# Altium schematic sheet UBX_NORA_B1_SCHEM_0001_NORA_B1_Module.SchDoc: UBX_NORA_B1_SCHEM_0001_NORA_B1_Module
size A3; Date: 7/24/2020; CompanyName: U-blox; DrawnBy: EMOO; Engineer: EMOO; Organization: U-blox; Address1: 3950 Fairview Industrial Dr SE #100; Address2: Salem, OR 97302; SheetNumber: 1; SheetTotal: 6; Website: www.u-blox.com; SheetSize: B; SheetTitle: NORA_B1
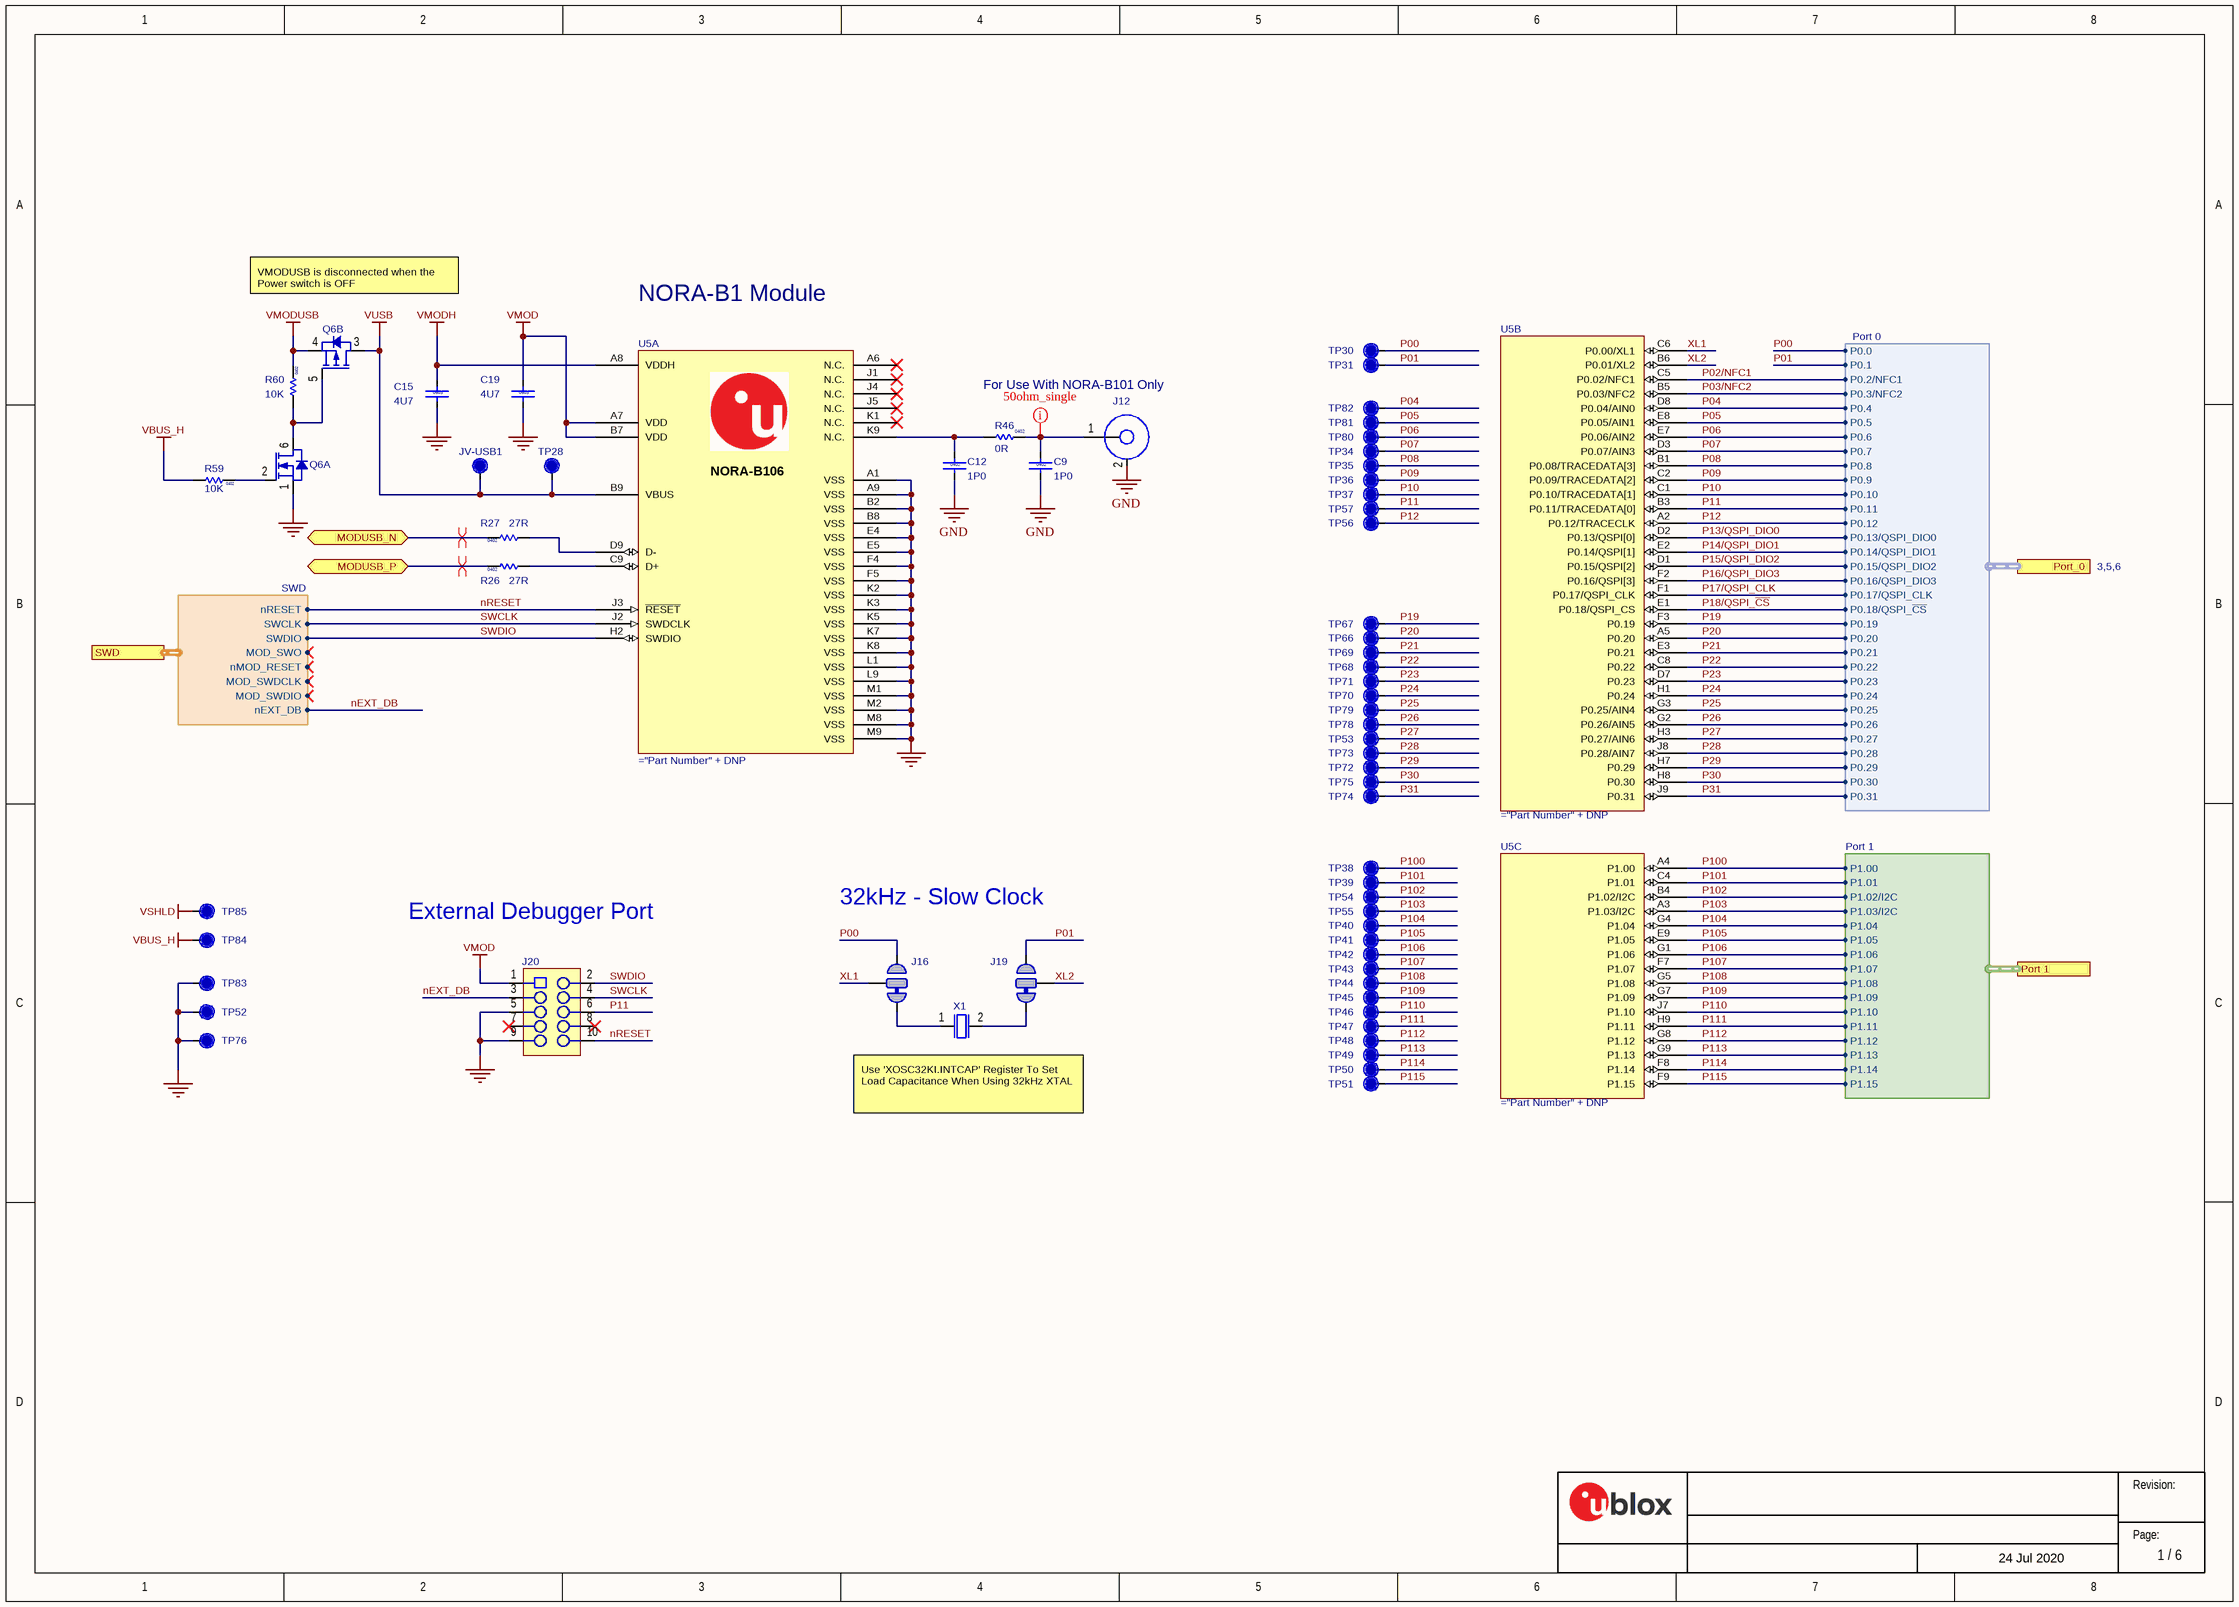
[diagram p0: UBX_NORA_B1_SCHEM_0001_NORA_B1_Module.SchDoc]

## Parts
C9  value 1P0  Size: 0402  [Cap 0402 HD]
C12  value 1P0  Size: 0402  [Cap 0402 HD]
C15  value 4U7  Size: 0603  [CAP 0603 HD]
C19  value 4U7  Size: 0603  [CAP 0603 HD]
J12  (no value)  [U.FL_3Pin]
J16  (no value)  [Solderbridge-Option]  (net tie, no BOM)
J19  (no value)  [Solderbridge-Option]  (net tie, no BOM)
J20  (no value)  [FTSH-105-01-F-DV-K]
JV-USB1  TP  [TP10R_NO_SILK]  (value not drawn)  (no BOM)
Q6  (no value)  [SOT-563]  (parts A,B of 2)
R26  value 27R  Size: 0402  [RES 0402 HD]
R27  value 27R  Size: 0402  [RES 0402 HD]
R46  value 0R  Size: 0402  [RES 0402 HD]
R59  value 10K  Size: 0402  [RES 0402 HD]
R60  value 10K  Size: 0402  [RES 0402 HD]
TP28  TP  [TP10R_NO_SILK]  (value not drawn)  (no BOM)
TP30  TP  [TP10R_NO_SILK]  (value not drawn)  (no BOM)
TP31  TP  [TP10R_NO_SILK]  (value not drawn)  (no BOM)
TP34  TP  [TP10R_NO_SILK]  (value not drawn)  (no BOM)
TP35  TP  [TP10R_NO_SILK]  (value not drawn)  (no BOM)
TP36  TP  [TP10R_NO_SILK]  (value not drawn)  (no BOM)
TP37  TP  [TP10R_NO_SILK]  (value not drawn)  (no BOM)
TP38  TP  [TP10R_NO_SILK]  (value not drawn)
TP39  TP  [TP10R_NO_SILK]  (value not drawn)
TP40  TP  [TP10R_NO_SILK]  (value not drawn)
TP41  TP  [TP10R_NO_SILK]  (value not drawn)
TP42  TP  [TP10R_NO_SILK]  (value not drawn)
TP43  TP  [TP10R_NO_SILK]  (value not drawn)
TP44  TP  [TP10R_NO_SILK]  (value not drawn)
TP45  TP  [TP10R_NO_SILK]  (value not drawn)
TP46  TP  [TP10R_NO_SILK]  (value not drawn)
TP47  TP  [TP10R_NO_SILK]  (value not drawn)
TP48  TP  [TP10R_NO_SILK]  (value not drawn)
TP49  TP  [TP10R_NO_SILK]  (value not drawn)
TP50  TP  [TP10R_NO_SILK]  (value not drawn)
TP51  TP  [TP10R_NO_SILK]  (value not drawn)
TP52  TP  [TP10R_NO_SILK]  (value not drawn)  (no BOM)
TP53  TP  [TP10R_NO_SILK]  (value not drawn)
TP54  TP  [TP10R_NO_SILK]  (value not drawn)
TP55  TP  [TP10R_NO_SILK]  (value not drawn)
TP56  TP  [TP10R_NO_SILK]  (value not drawn)  (no BOM)
TP57  TP  [TP10R_NO_SILK]  (value not drawn)  (no BOM)
TP66  TP  [TP10R_NO_SILK]  (value not drawn)
TP67  TP  [TP10R_NO_SILK]  (value not drawn)
TP68  TP  [TP10R_NO_SILK]  (value not drawn)
TP69  TP  [TP10R_NO_SILK]  (value not drawn)
TP70  TP  [TP10R_NO_SILK]  (value not drawn)
TP71  TP  [TP10R_NO_SILK]  (value not drawn)
TP72  TP  [TP10R_NO_SILK]  (value not drawn)
TP73  TP  [TP10R_NO_SILK]  (value not drawn)
TP74  TP  [TP10R_NO_SILK]  (value not drawn)
TP75  TP  [TP10R_NO_SILK]  (value not drawn)
TP76  TP  [TP10R_NO_SILK]  (value not drawn)  (no BOM)
TP78  TP  [TP10R_NO_SILK]  (value not drawn)
TP79  TP  [TP10R_NO_SILK]  (value not drawn)
TP80  TP  [TP10R_NO_SILK]  (value not drawn)  (no BOM)
TP81  TP  [TP10R_NO_SILK]  (value not drawn)  (no BOM)
TP82  TP  [TP10R_NO_SILK]  (value not drawn)  (no BOM)
TP83  TP  [TP10R_NO_SILK]  (value not drawn)  (no BOM)
TP84  TP  [TP10R_NO_SILK]  (value not drawn)  (no BOM)
TP85  TP  [TP10R_NO_SILK]  (value not drawn)  (no BOM)
U5  (no value)  [NORA-B106]  (parts A,B,C of 3)
X1  (no value)  [XTAL_3215]

## Ports
MODUSB_N (bidir), MODUSB_P (bidir), Port 1 (harness Port 1), Port_0 (harness Port 0), SWD (harness SWD)

## Harnesses
Port 0: P0.4, P0.5, P0.6, P0.7, P0.8, P0.9, P0.10, P0.11, P0.12, P0.19, P0.20, P0.21, P0.22, P0.23, P0.24, P0.25, P0.26, P0.27, P0.28, P0.29, P0.30, P0.31, P0.3/NFC2, P0.2/NFC1, P0.13/QSPI_DIO0, P0.14/QSPI_DIO1, P0.15/QSPI_DIO2, P0.16/QSPI_DIO3, P0.18/QSPI_~{CS}, P0.17/QSPI_CLK, P0.0, P0.1
Port 1: P1.00, P1.01, P1.02/I2C, P1.03/I2C, P1.04, P1.05, P1.06, P1.07, P1.08, P1.09, P1.10, P1.11, P1.12, P1.13, P1.14, P1.15
SWD: MOD_SWDIO, MOD_SWDCLK, SWCLK, SWDIO, nMOD_RESET, MOD_SWO, nRESET, nEXT_DB

## Nets
GND: C9.2 C12.2 C15.2 C19.2 J12.2 J20.5 J20.9 Q6.1(S1) TP52.1 TP76.1 TP83.1 U5.A1(VSS) U5.A9(VSS) U5.B2(VSS) U5.B8(VSS) U5.E4(VSS) U5.E5(VSS) U5.F4(VSS) U5.F5(VSS) U5.K2(VSS) U5.K3(VSS) U5.K5(VSS) U5.K7(VSS) U5.K8(VSS) U5.L1(VSS) U5.L9(VSS) U5.M1(VSS) U5.M2(VSS) U5.M8(VSS) U5.M9(VSS)
VBUS_H: R59.1 TP84.1
VMOD: C19.1 J20.1 U5.A7(VDD) U5.B7(VDD)
VMODH: C15.1 U5.A8(VDDH)
VMODUSB: Q6.4(S2) R60.2
VSHLD: TP85.1
VUSB: JV-USB1.1 Q6.3(D2) TP28.1 U5.B9(VBUS)
MODUSB_N: R27.2 ; port MODUSB_N
MODUSB_P: R26.2 ; port MODUSB_P
nEXT_DB: J20.3 ; port SWD.nEXT_DB
nRESET: J20.10 U5.J3(~{RESET}) ; port SWD.nRESET
P00: J16.3 TP30.1 ; port Port_0.P0.0
P01: J19.3 TP31.1 ; port Port_0.P0.1
P02/NFC1: U5.C5(P0.02/NFC1) ; port Port_0.P0.2/NFC1
P03/NFC2: U5.B5(P0.03/NFC2) ; port Port_0.P0.3/NFC2
P04: TP82.1 U5.D8(P0.04/AIN0) ; port Port_0.P0.4
P05: TP81.1 U5.E8(P0.05/AIN1) ; port Port_0.P0.5
P06: TP80.1 U5.E7(P0.06/AIN2) ; port Port_0.P0.6
P07: TP34.1 U5.D3(P0.07/AIN3) ; port Port_0.P0.7
P08: TP35.1 U5.B1(P0.08/TRACEDATA[3]) ; port Port_0.P0.8
P09: TP36.1 U5.C2(P0.09/TRACEDATA[2]) ; port Port_0.P0.9
P10: TP37.1 U5.C1(P0.10/TRACEDATA[1]) ; port Port_0.P0.10
P11: J20.6 TP57.1 U5.B3(P0.11/TRACEDATA[0]) ; port Port_0.P0.11
P12: TP56.1 U5.A2(P0.12/TRACECLK) ; port Port_0.P0.12
P13/QSPI_DIO0: U5.D2(P0.13/QSPI[0]) ; port Port_0.P0.13/QSPI_DIO0
P14/QSPI_DIO1: U5.E2(P0.14/QSPI[1]) ; port Port_0.P0.14/QSPI_DIO1
P15/QSPI_DIO2: U5.D1(P0.15/QSPI[2]) ; port Port_0.P0.15/QSPI_DIO2
P16/QSPI_DIO3: U5.F2(P0.16/QSPI[3]) ; port Port_0.P0.16/QSPI_DIO3
P17/QSPI_CLK: U5.F1(P0.17/QSPI_CLK) ; port Port_0.P0.17/QSPI_CLK
P18/QSPI_~{CS}: U5.E1(P0.18/QSPI_CS) ; port Port_0.P0.18/QSPI_~{CS}
P19: TP67.1 U5.F3(P0.19) ; port Port_0.P0.19
P20: TP66.1 U5.A5(P0.20) ; port Port_0.P0.20
P21: TP69.1 U5.E3(P0.21) ; port Port_0.P0.21
P22: TP68.1 U5.C8(P0.22) ; port Port_0.P0.22
P23: TP71.1 U5.D7(P0.23) ; port Port_0.P0.23
P24: TP70.1 U5.H1(P0.24) ; port Port_0.P0.24
P25: TP79.1 U5.G3(P0.25/AIN4) ; port Port_0.P0.25
P26: TP78.1 U5.G2(P0.26/AIN5) ; port Port_0.P0.26
P27: TP53.1 U5.H3(P0.27/AIN6) ; port Port_0.P0.27
P28: TP73.1 U5.J8(P0.28/AIN7) ; port Port_0.P0.28
P29: TP72.1 U5.H7(P0.29) ; port Port_0.P0.29
P30: TP75.1 U5.H8(P0.30) ; port Port_0.P0.30
P31: TP74.1 U5.J9(P0.31) ; port Port_0.P0.31
P100: TP38.1 U5.A4(P1.00) ; port Port 1.P1.00
P101: TP39.1 U5.C4(P1.01) ; port Port 1.P1.01
P102: TP54.1 U5.B4(P1.02/I2C) ; port Port 1.P1.02/I2C
P103: TP55.1 U5.A3(P1.03/I2C) ; port Port 1.P1.03/I2C
P104: TP40.1 U5.G4(P1.04) ; port Port 1.P1.04
P105: TP41.1 U5.E9(P1.05) ; port Port 1.P1.05
P106: TP42.1 U5.G1(P1.06) ; port Port 1.P1.06
P107: TP43.1 U5.F7(P1.07) ; port Port 1.P1.07
P108: TP44.1 U5.G5(P1.08) ; port Port 1.P1.08
P109: TP45.1 U5.G7(P1.09) ; port Port 1.P1.09
P110: TP46.1 U5.J7(P1.10) ; port Port 1.P1.10
P111: TP47.1 U5.H9(P1.11) ; port Port 1.P1.11
P112: TP48.1 U5.G8(P1.12) ; port Port 1.P1.12
P113: TP49.1 U5.G9(P1.13) ; port Port 1.P1.13
P114: TP50.1 U5.F8(P1.14) ; port Port 1.P1.14
P115: TP51.1 U5.F9(P1.15) ; port Port 1.P1.15
SWCLK: J20.4 U5.J2(SWDCLK) ; port SWD.SWCLK
SWDIO: J20.2 U5.H2(SWDIO) ; port SWD.SWDIO
XL1: J16.2 U5.C6(P0.00/XL1)
XL2: J19.2 U5.B6(P0.01/XL2)
NetC9_1: C9.1 J12.1(ANT) R46.2
NetC12_1: C12.1 R46.1 U5.K9(N.C.)
NetJ16_1: J16.1 X1.1
NetJ19_1: J19.1 X1.2
NetQ6_2: Q6.2(G1) R59.2
NetQ6_5: Q6.5(G2) Q6.6(D1) R60.1
NetR26_1: R26.1 U5.C9(D+)
NetR27_1: R27.1 U5.D9(D-)

Not connected (* = marked no-connect by the designer): J20 7* 8*; U5 A6(N.C.)* J1(N.C.)* J4(N.C.)* J5(N.C.)* K1(N.C.)*

## Layout directives
differential pair; net class USB_DIFF: MODUSB_N, MODUSB_P
net class 50_ohm_se: NetC9_1

## Notes on the sheet
- VMODUSB is disconnected when the Power switch is OFF
- NORA-B1 Module
- For Use With NORA-B101 Only
- 32kHz - Slow Clock
- External Debugger Port
- (near X1) Use 'XOSC32KI.INTCAP' Register To Set Load Capacitance When Using 32kHz XTAL
- 24 Jul 2020
- Revision:
- Page:

## Library data of the parts
C9 C12 = UBXH01-0009002: CAP CER C0G 0402 1P0 +/-0.1P 50V; Manufacturer: Murata Manufacturing Company, Ltd.; Manufacturer P/N: GRM1555C1H1R0BA01; Editor: massimo.vlacci; Released by: sandro.sestan; Env: ROHS; Permitted Use: Volume Products; Perferred: PREF; Mfg P/N Status: NRND; Mfg P/N Split: 100; Mfg P/N Released: Yes; Part Number: UBXH01-0009002; Tolerance: +/-0.1P; Max Voltage: 50V; Min Operating Temp: -55°C; Max Operating Temp: 125°C; Part Type: Capacitor; Release Data: 2010-02-19T10:36:53; UBX Wiki: https://wiki.u-blox.com/bin/view/Operations/PartDetails?index=5431; RefDes: C; Manufacturer 2: Murata Manufacturing Company, Ltd.; Manufacturer P/N 2: GRM1555C1H1R0BZ01; Mfg P/N Status 2: Obsolete; Mfg P/N Split 2: 0; Mfg P/N Released 2: No
C15 C19 = UBXH01-2002003: CAP CER X5R 0603 4U7 10% 6.3V; Manufacturer: Murata Manufacturing Company, Ltd.; Manufacturer P/N: GRM188R61C475KE11; Editor: philippe.largier; Released by: roland.rust; Env: GREEN; Permitted Use: Volume Products; Perferred: PREF; Mfg P/N Status: Active; Mfg P/N Split: 100; Mfg P/N Released: Yes; Part Number: UBXH01-2002003; Tolerance: 10%; Max Voltage: 6.3V; Part Type: Capacitor; Release Data: 2016-02-02T16:39:45; UBX Wiki: https://wiki.u-blox.com/bin/view/Operations/PartDetails?index=5742; RefDes: C; Mfg P/N Datasheet: https://wiki.u-blox.com/bin/view/Generic/Docs/DocumentSummary?index=30154; Manufacturer 2: Murata Manufacturing Company, Ltd.; Manufacturer P/N 2: GRM188R61E475KE11; Mfg P/N Status 2: Active; Mfg P/N Split 2: 0; Mfg P/N Released 2: Yes; Mfg P/N Datasheet 2: https://wiki.u-blox.com/bin/view/Generic/Docs/DocumentSummary?index=30500; Manufacturer 3: Samsung Electro-Mechanics; Manufacturer P/N 3: CL10A475KO8NNN; Mfg P/N Status 3: NRND; Mfg P/N Split 3: 0; Mfg P/N Released 3: Yes; Mfg P/N Datasheet 3: https://wiki.u-blox.com/bin/view/Generic/Docs/DocumentSummary?index=28177
J12 = UBXH04-0000657: CONN U.FL STRAIGHT RECEPTACLE; Manufacturer P/N: U.FL-R-SMT-1(80); Manufacturer: Hirose; Value: U.FL-R-SMT-1(80); Editor: cam.nichols; Released by: eric.moog; Env: GREEN; Permitted Use: Volume Products; Perferred: PREF; Mfg P/N Status: Active; Mfg P/N Split: 100; Mfg P/N Released: No; Part Number: UBXH04-0000657; Min Operating Temp: -40°C; Max Operating Temp: 105°C; Part Type: Connector; Release Data: 2020-09-04T22:33:09; UBX Wiki: https://wiki.u-blox.com/bin/view/Operations/PartDetails?index=33335; RefDes: J; Mfg P/N Datasheet: https://wiki.u-blox.com/bin/view/Generic/Docs/DocumentSummary?index=32065; Manufacturer 2: Toptek; Manufacturer P/N 2: AB02001-126; Mfg P/N Status 2: Active; Mfg P/N Split 2: 0; Mfg P/N Released 2: No; Mfg P/N Datasheet 2: https://wiki.u-blox.com/bin/view/Generic/Docs/DocumentSummary?index=33337
J16 J19 = UBXH00-0000083: SOLDERBRIDGE-OPTION; Editor: aneeb.sohail; Env: GREEN; Permitted Use: Volume Products; Perferred: PREF; Part Number: UBXH00-0000083; Min Operating Temp: -55°C; Max Operating Temp: 155°C; Part Type: Connector; UBX Wiki: https://wiki.u-blox.com/bin/view/Operations/PartDetails?index=36362; RefDes: J
J20 = UBXH04-0000194: 2-ROW SMD-PCB CONN 50MIL GRID 10 -PIN 0.41MM SQUARE 4.0MM KEYED; Manufacturer P/N: FTSH-105-01-L-DV-K; Manufacturer: Samtec; Value: FTSH-105-01-L-DV-K; Editor: par.hakansson; Released by: adam.johansson; Env: ROHS; Permitted Use: Volume Products; Perferred: PREF; Mfg P/N Status: Active; Mfg P/N Split: 100; Mfg P/N Released: Yes; Part Number: UBXH04-0000194; Min Operating Temp: -40°C; Max Operating Temp: 85°C; Part Type: Connector; Release Data: 2015-11-06T11:35:39; UBX Wiki: https://wiki.u-blox.com/bin/view/Operations/PartDetails?index=20823; RefDes: J; Mfg P/N Datasheet: https://wiki.u-blox.com/bin/view/Generic/Docs/DocumentSummary?index=20824
JV-USB1 TP28 TP30 TP31 TP34-TP57 TP66-TP76 TP78-TP85 = UBXH00-0000096: TESTPOINT 1MM CIRCULAR NO SILKSCREEN; Editor: eric.moog; Permitted Use: Volume Products; Perferred: PREF; Part Number: UBXH00-0000096; Min Operating Temp: -55°C; Max Operating Temp: 125°C; Part Type: Testpoint; UBX Wiki: https://wiki.u-blox.com/bin/view/Operations/PartDetails?index=38784; Env: N/A; RefDes: TP
Q6 = UBXH20-0000084: SMALL SIGNAL COMPLEMENTARY W/ ESD PROTECTION MOSFET SOT-563-6 PACKAGE; Manufacturer: ON Semiconductor; Value: NTZD3155CT1G; Editor: pierpaolo.arban; Released by: matej.budin; Env: ROHS; Permitted Use: Support Products; Perferred: PREF; Mfg P/N Status: Active; Mfg P/N Split: 100; Mfg P/N Released: Yes; Part Number: UBXH20-0000084; Min Operating Temp: -55°C; Max Operating Temp: 155°C; Part Type: Transistor; Release Data: 2023-01-26T11:59:16; UBX Wiki: https://wiki.u-blox.com/bin/view/Operations/PartDetails?index=37717; RefDes: Q; Manufacturer P/N: NTZD3155CT1G; Mfg P/N Datasheet: https://wiki.u-blox.com/bin/view/Generic/Docs/DocumentSummary?index=9037
R26 R27 = UBXH18-0008011: RES THICK FILM CHIP 0402 27R 5% 100mW; Manufacturer: KOA; Manufacturer P/N: RK73B1ETTD270J; Editor: roland.rust; Env: ROHS; Permitted Use: Volume Products; Perferred: PREF; Mfg P/N Status: NRND; Mfg P/N Split: 100; Mfg P/N Released: Yes; Part Number: UBXH18-0008011; Tolerance: 5%; Max Power: 100mW; Part Type: Resistor; Released by: roland.rust; Release Data: 2005-07-22T13:59:44; UBX Wiki: https://wiki.u-blox.com/bin/view/Operations/PartDetails?index=6883; RefDes: R; Manufacturer 2: YAGEO; Manufacturer P/N 2: 2322_705_70279_L; Mfg P/N Status 2: Obsolete; Mfg P/N Split 2: 0; Mfg P/N Released 2: Yes
R46 = UBXH18-0003002: RES THICK FILM CHIP 0402 0R 0 100mW; Manufacturer: KOA; Manufacturer P/N: RK73Z1ETTD; Tolerance: 0; Editor: charlotte.biber; Released by: peter.mueller; Env: ROHS; Permitted Use: Volume Products; Perferred: PREF; Mfg P/N Status: NRND; Mfg P/N Split: 100; Mfg P/N Released: Yes; Part Number: UBXH18-0003002; Max Power: 100mW; Part Type: Resistor; Release Data: 2012-06-05T09:49:55; UBX Wiki: https://wiki.u-blox.com/bin/view/Operations/PartDetails?index=6611; RefDes: R; Manufacturer 2: YAGEO; Manufacturer P/N 2: 2322_705_91001_L; Mfg P/N Status 2: NRND; Mfg P/N Split 2: 0; Mfg P/N Released 2: Yes
R59 R60 = UBXH18-0000065: RES THICK FILM CHIP 0402 10K 1% 63mW; Manufacturer: KOA; Manufacturer P/N: RK73H1ETTP1002F; Editor: erian.bezhani; Released by: massimo.vlacci; Env: ROHS; Permitted Use: Volume Products; Perferred: PREF; Mfg P/N Status: Active; Mfg P/N Split: 100; Mfg P/N Released: Yes; Part Number: UBXH18-0000065; Tolerance: 1%; Max Power: 63mW; Part Type: Resistor; Release Data: 2012-06-08T18:02:21; UBX Wiki: https://wiki.u-blox.com/bin/view/Operations/PartDetails?index=16837; RefDes: R; Mfg P/N Datasheet: https://wiki.u-blox.com/bin/view/Generic/Docs/DocumentSummary?index=8222
U5 = UBXH14-0000700: SHORT RANGE BLE AND 802.15.4 MODULE U-BLOX NORA-B106 5.5V 10mA; Manufacturer P/N: NORA-B106-00B-00; Manufacturer Part Number 1: NORA-B106-00B; Body Size: 14.3mm x 10.4mm; Component Mounting Type: SMT; Core Architecture: Dual Cortex-M33; Flash Size: 1MB; Internal Antenna: Yes; Max Oper Temp in C: +105; MFG Package: NORA-82; Min Oper Temp in C: -40; RF Frequency: 2.4GHZ; SMT Pitch: 1.1mm; Value: NORA-B106-00B-00; Editor: eric.moog; Env: ROHS; Permitted Use: Support Products; Perferred: PREF; Mfg P/N Status: Active; Mfg P/N Split: 100; Mfg P/N Released: No; ComponentLink1URL: *; ComponentLink1Description: Datasheet; ComponentLink2URL: *; ComponentLink2Description: Supplier link; Part Number: UBXH14-0000700; Part Name: NORA-B106; Part_Type: Module; Manufacturer: u-blox; Height: 1.8mm; Package Type: LGA; Pins: 82; Use in new designs: Yes; Voltage: 5.5V; Manufacturer 1: u-blox; Max Voltage: 5.5V; Max Current: 10mA; Min Operating Temp: -40°C; Max Operating Temp: 105°C; Part Type: RF; UBX Wiki: https://wiki.u-blox.com/bin/view/Operations/PartDetails?index=38882; RefDes: A; Mfg P/N Datasheet: https://wiki.u-blox.com/bin/view/Generic/Docs/DocumentSummary?index=38876
X1 = UBXH21-0000123: CRYSTAL CL=6PF 3.2 X 1.5 MM 32.768KHZ 20PPM; Manufacturer P/N: ABS07-120-32.768KHZ-T; Manufacturer: ABRACON; Editor: martin.grasse; Env: ROHS; Permitted Use: Support Products; Perferred: PREF; Mfg P/N Status: NRND; Mfg P/N Split: 100; Mfg P/N Released: No; Part Number: UBXH21-0000123; Value: 32.768KHZ; Tolerance: 20PPM; Part Type: Crystal; UBX Wiki: https://wiki.u-blox.com/bin/view/Operations/PartDetails?index=27619; RefDes: Y; Mfg P/N Datasheet: https://wiki.u-blox.com/bin/view/Generic/Docs/DocumentSummary?index=27621